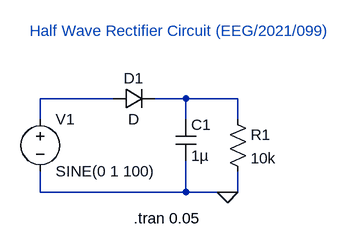
[diagram p0: schematic EEG_2021_099 Half wave Rectifier Circuit.asc]
EEG_2021_099 Half wave Rectifier Circuit.asc, the LTspice schematic file:
Version 4
SHEET 1 880 680
WIRE 128 64 16 64
WIRE 240 64 192 64
WIRE 320 64 240 64
WIRE 16 96 16 64
WIRE 240 96 240 64
WIRE 320 96 320 64
WIRE 16 208 16 176
WIRE 240 208 240 160
WIRE 240 208 16 208
WIRE 304 208 240 208
WIRE 320 208 320 176
WIRE 320 208 304 208
FLAG 304 208 0
SYMBOL voltage 16 80 R0
WINDOW 123 0 0 Left 0
WINDOW 39 0 0 Left 0
SYMATTR InstName V1
SYMATTR Value SINE(0 1 100)
SYMBOL diode 128 80 R270
WINDOW 0 32 32 VTop 2
WINDOW 3 0 32 VBottom 2
SYMATTR InstName D1
SYMBOL res 304 80 R0
SYMATTR InstName R1
SYMATTR Value 10k
SYMBOL cap 224 96 R0
SYMATTR InstName C1
SYMATTR Value 1µ
TEXT 160 248 Left 2 !.tran 0.05
TEXT 0 -40 Left 2 ;Half Wave Rectifier Circuit (EEG/2021/099)

The netlist it stands for:
* EEG_2021_099 Half wave Rectifier Circuit.asc
V1 N001 0 SINE(0 1 100)
D1 N001 N002 D
R1 N002 0 10k
C1 N002 0 1µ
.model D D
.lib standard.dio
.tran 0.05
* Half Wave Rectifier Circuit (EEG/2021/099)
.backanno
.end